# EAGLE design MiniGen (EAGLE 6.5.0)
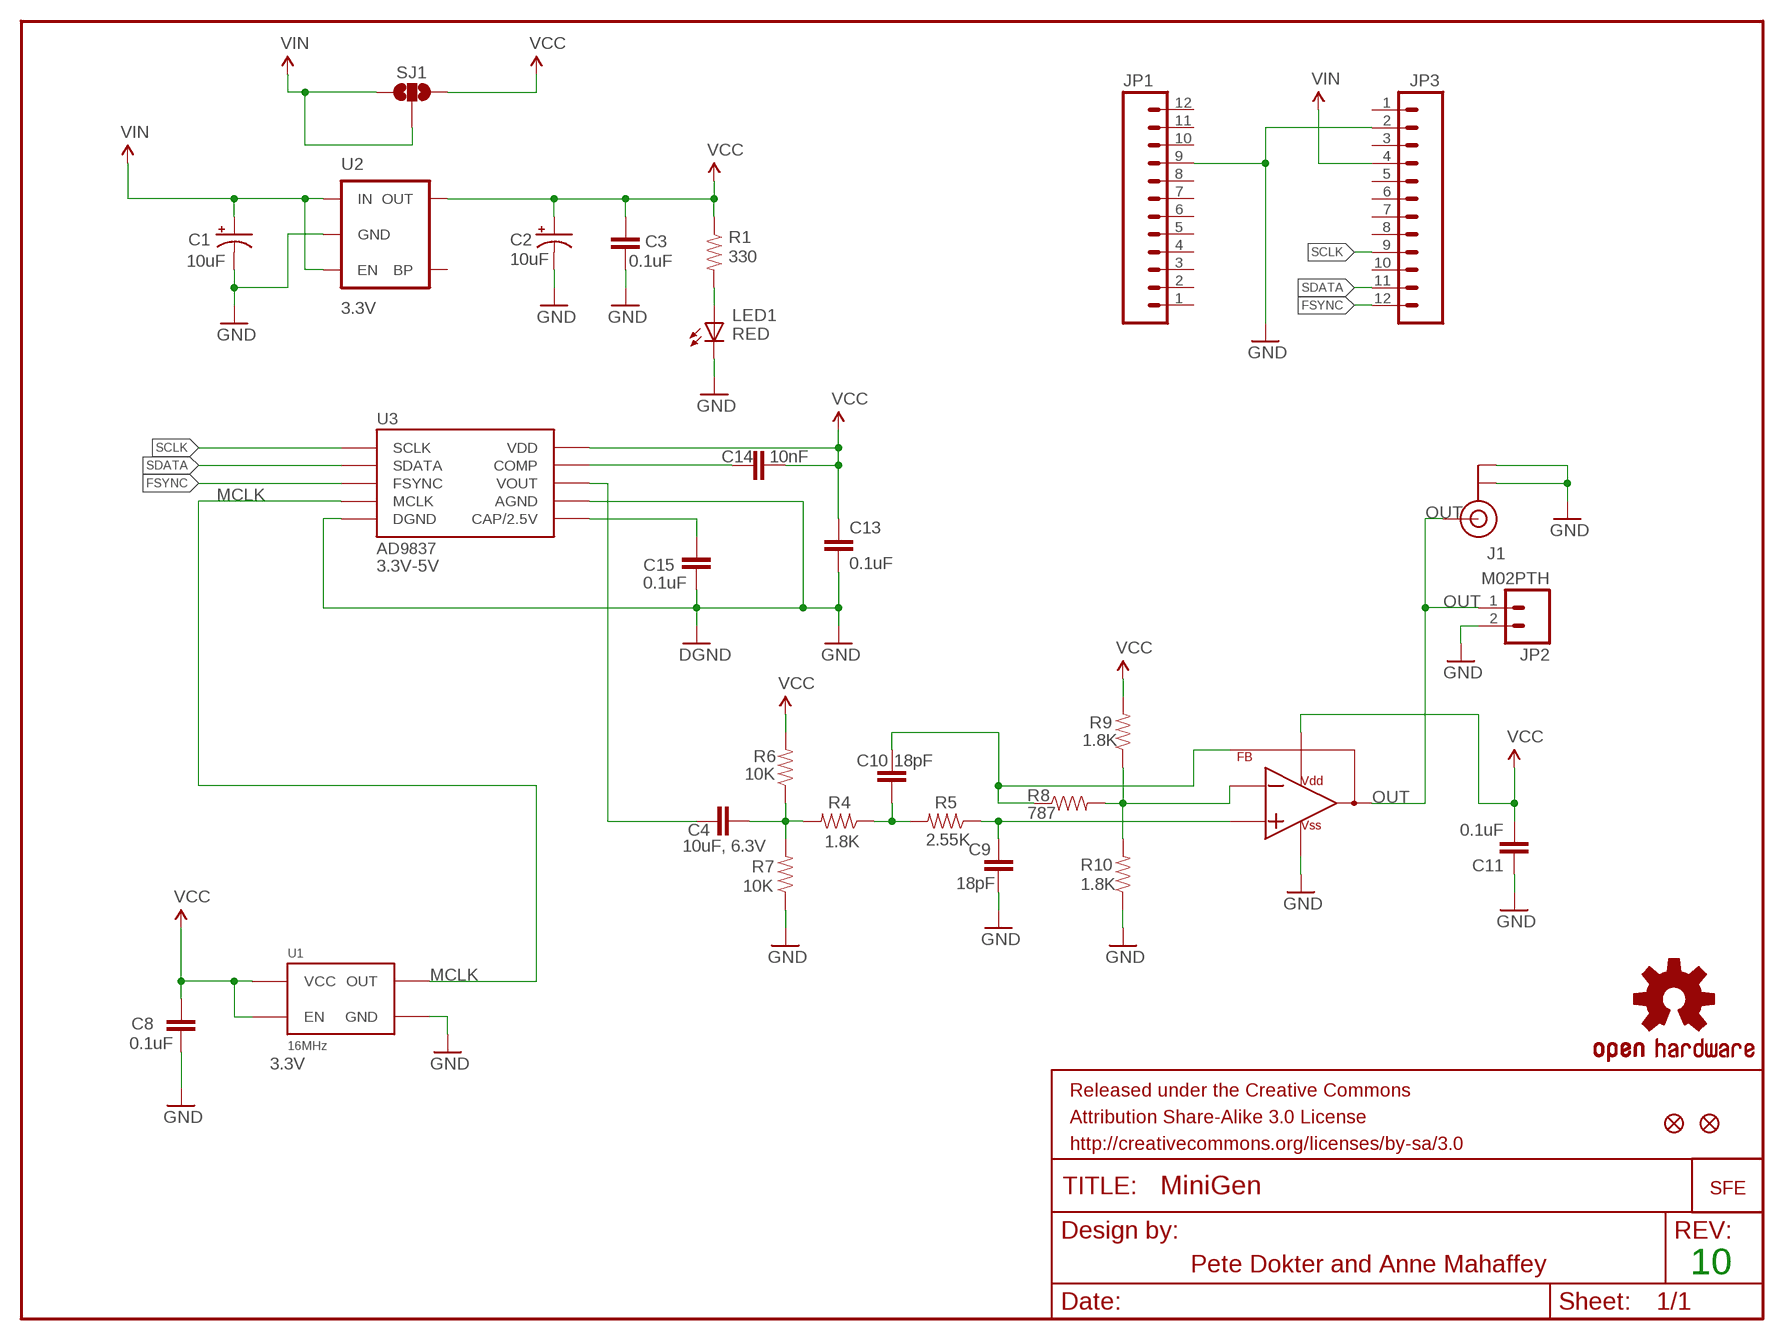
[diagram p0: schematic, sheet 1]

## Parts
C1  10uF  10UF-20V-10%(TANT)  [EIA3528]
C2  10uF  10UF-20V-10%(TANT)  [EIA3528]
C3  0.1uF  0.1UF-25V(+80/-20%)(0603)  [0603-CAP]
C4  10uF, 6.3V  10UF-6.3V-20%(0603)  [0603-CAP]
C8  0.1uF  0.1UF-25V(+80/-20%)(0603)  [0603-CAP]
C9  18pF  18PF-50V-5%(0603)  [0603-CAP]
C10  18pF  18PF-50V-5%(0603)  [0603-CAP]
C11  0.1uF  0.1UF-25V(+80/-20%)(0603)  [0603-CAP]
C13  0.1uF  0.1UF-25V(+80/-20%)(0603)  [0603-CAP]
C14  10nF  10NF/10000PF-50V-10%(0603)  [0603-CAP]
C15  0.1uF  0.1UF-25V(+80/-20%)(0603)  [0603-CAP]
FID1  FIDUCIAL1X2  [FIDUCIAL-1X2]
FID2  FIDUCIAL1X2  [FIDUCIAL-1X2]
FRAME1  FRAME-LETTER  [CREATIVE_COMMONS]
J1  U.FL  [U.FL]
JP1  M12PTH  [1X12]
JP2  M02PTH  [1X02]
JP3  M12PTH  [1X12]
JP4  LOGO-SFENEW  [SFE-NEW-WEBLOGO]
LED1  RED  LED-RED0603  [LED-0603]
R1  330  330OHM1/10W1%(0603)  [0603-RES]
R4  1.8K  1.8KOHM1/10W1%(0603)  [0603-RES]
R5  2.55K  2.55KOHM-1/10W-1%(0603)  [0603-RES]
R6  10K  10KOHM1/10W1%(0603)0603  [0603-RES]
R7  10K  10KOHM1/10W1%(0603)0603  [0603-RES]
R8  787  787-1%  [0603-RES]
R9  1.8K  1.8KOHM1/10W1%(0603)  [0603-RES]
R10  1.8K  1.8KOHM1/10W1%(0603)  [0603-RES]
SJ1  SOLDERJUMPER_2WAYT  [SJ_2]
U1  16MHz  OSCILLATORXTAL-11225  [CRYSTAL-SMD-7X5]
U2  3.3V  MIC52053.3V  [SOT23-5]
U3  AD9837  [AD9837]
U4  ADC8045  [SO08]
U$2  OSHW-LOGOS  [OSHW-LOGO-S]

## Nets
FSYNC: JP3.12 U3.P$8(FSYNC)
GND: C1.C(-) C2.C(-) C3.2 C8.2 C9.1 C11.1 C13.2 C15.2 J1.P$1(GND) J1.P$2(GND) JP1.9 JP2.2 JP3.2 LED1.C R7.1 R10.1 U1.P$2(GND) U2.2(GND) U3.P$0(DGND) U3.P$4(DGND) U3.P$9(AGND) U4.4(VSS)
MCLK: U1.P$3(OUT) U3.P$5(MCLK)
N$3: LED1.A R1.2
N$7: C9.2 R5.1 U4.3(IN+)
N$8: C10.1 R4.1 R5.2
N$9: C10.2 R8.1 U4.1(FB)
N$10: C15.1 U3.P$3(CAP/2.5V)
N$12: R8.2 R9.1 R10.2 U4.2(IN-)
N$14: C4.2 R4.2 R6.1 R7.2
N$21: C4.1 U3.P$10(VOUT)
N$23: C14.1 U3.P$1(COMP)
OUT: J1.P$3(SIGNAL) JP2.1 U4.6(OUT)
SCLK: JP3.9 U3.P$7(SCLK)
SDATA: JP3.11 U3.P$6(SDATA)
VCC: C2.A(+) C3.1 C8.1 C11.2 C13.1 C14.2 R1.1 R6.2 R9.2 SJ1.3 U1.P$1(EN) U1.P$4(VCC) U2.5(OUT) U3.P$2(VDD) U4.7(VDD)
VIN: C1.A(+) JP3.4 SJ1.1 SJ1.2 U2.1(IN) U2.3(EN)
Unconnected: JP1.1 JP1.2 JP1.3 JP1.4 JP1.5 JP1.6 JP1.7 JP1.8 JP1.10 JP1.11 JP1.12 JP3.1 JP3.3 JP3.5 JP3.6 JP3.7 JP3.8 JP3.10 U2.4(BP)

## Notes on the sheet
- 3.3V-5V
- 3.3V
- Pete Dokter and Anne Mahaffey | 10

## Library data of the parts
C1 C2 = SparkFun-Capacitors:10UF-20V-10%(TANT): CAP-08063; PROD_ID: CAP-08063
C3 C8 C11 C13 C15 = SparkFun-Capacitors:0.1UF-25V(+80/-20%)(0603): CAP-00810 Ceramic Standard decoupling cap; PROD_ID: CAP-00810
C4 = SparkFun-Capacitors:10UF-6.3V-20%(0603): CAP-11015; PROD_ID: CAP-11015; VALUE: 10uF
C9 C10 = SparkFun-Capacitors:18PF-50V-5%(0603): CAP-08267; PROD_ID: CAP-08267
C14 = SparkFun-Capacitors:10NF/10000PF-50V-10%(0603): CAP-00867; PROD_ID: CAP-00867
FID1 FID2 = SparkFun-Aesthetics:FIDUCIAL: Fiducial Alignment Points Various fiducial points for machine vision alignment.
FRAME1 = SparkFun-Aesthetics:FRAME-LETTER: Schematic Frame Standard 8.5x11 US Letter frame
J1 = SparkFun-Connectors:U.FL: SMD antenna connector- WRL-09144; PROD_ID: CONN-09193; VALUE: U.FL
JP1 JP3 = SparkFun-Connectors:M12: Header 12 Standard 12-pin 0.1" header. Use with straight break away headers (SKU : PRT-00116), right angle break away headers (PRT-00553), swiss pins (PRT-00743), machine pins (PRT-00117), and female headers (PRT-00115).
JP2 = SparkFun-Connectors:M02: Standard 2-pin 0.1" header. Use with - straight break away headers ( PRT-00116) - right angle break away headers (PRT-00553) - swiss pins (PRT-00743) - machine pins (PRT-00117) - female headers (PRT-00115) Molex polarized connector foot print use with: PRT-08233 with associated crimp pins and housings. 2.54_SCREWTERM for use with PRT-10571. 3.5mm Screw Terminal footprints for PRT-08084 5mm Screw Terminal footprints for use with PRT-08433
JP4 = SparkFun-Aesthetics:LOGO-SFE: Spark Fun Electronics PCB Logo This is the standard Spark Fun Electronics PCB logo.
LED1 = SparkFun-LED:LED-RED: Assorted Red LEDs LilyPad 1206- DIO-09912 1206- DIO-00809 0603- DIO-00819; PROD_ID: DIO-00819
R1 = SparkFun-Resistors:330OHM1/10W1%(0603): RES-00818; PROD_ID: RES-00818
R4 R9 R10 = SparkFun-Resistors:1.8KOHM1/10W1%(0603): RES-09119; PROD_ID: RES-09119; VALUE: 1.8k
R5 = SparkFun-Resistors:2.55KOHM-1/10W-1%(0603): RES-11227; PROD_ID: RES-11227; VALUE: 2.55k
R6 R7 = SparkFun-Resistors:10KOHM1/10W1%(0603): RES-00824; PROD_ID: RES-00824
R8 = SparkFun-Resistors:787-1%: 787-ohm SMT 1/10W - 1% (0603) RES-11228; PROD_ID: RES-11228
SJ1 = SparkFun-Passives:SOLDERJUMPER_2WAY: Solder Jumper 2 way solder jumper
U1 = SparkFun-FreqCtrl:OSCILLATOR: Generic 5x3 and 7x5 oscillators; PROD_ID: XTAL-11225
U2 = SparkFun-PowerIC:MIC5205: MIC5205 150mA vreg 3.3V - VREG-00822 5V - VREG-00823; PROD_ID: VREG-00822
U3 = SparkFun-AnalogIC:AD9837: Programmable waveform generator, sine, triangular, and square wave outputs.; PROD_ID: IC-11223; VALUE: AD9837BCPZ
U4 = SparkFun-AnalogIC:ADC8045: Unity-gain stable feedback amplifier. Low noise, low distortion, 1GHz BW.; PROD_ID: IC-11224; VALUE: ADC8045
U$2 = SparkFun-Aesthetics:OSHW-LOGO: Open Source Hardware Logo This logo indicates the piece of hardware it is found on incorporates a OSHW license and/or adheres to the definition of open source hardware found here: http://freedomdefined.org/OSHW

## Board
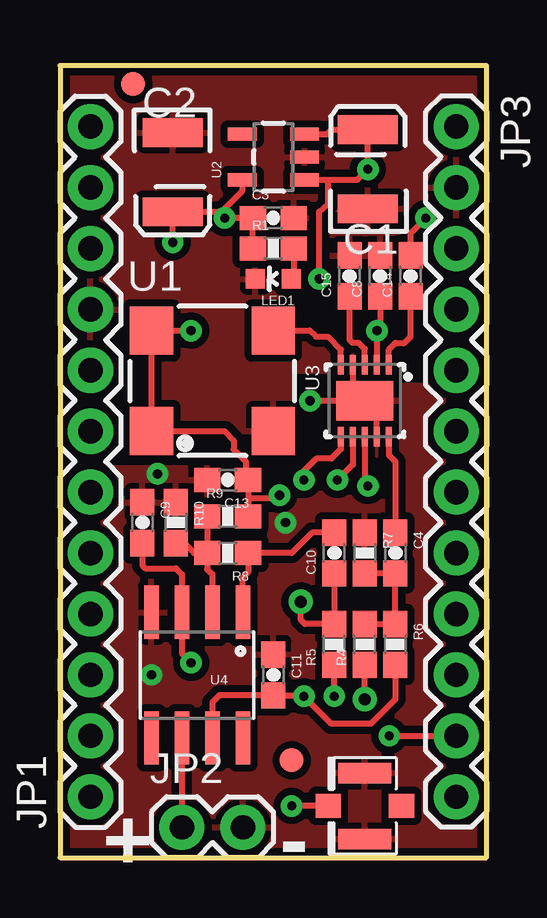
[diagram p1: board, top side]
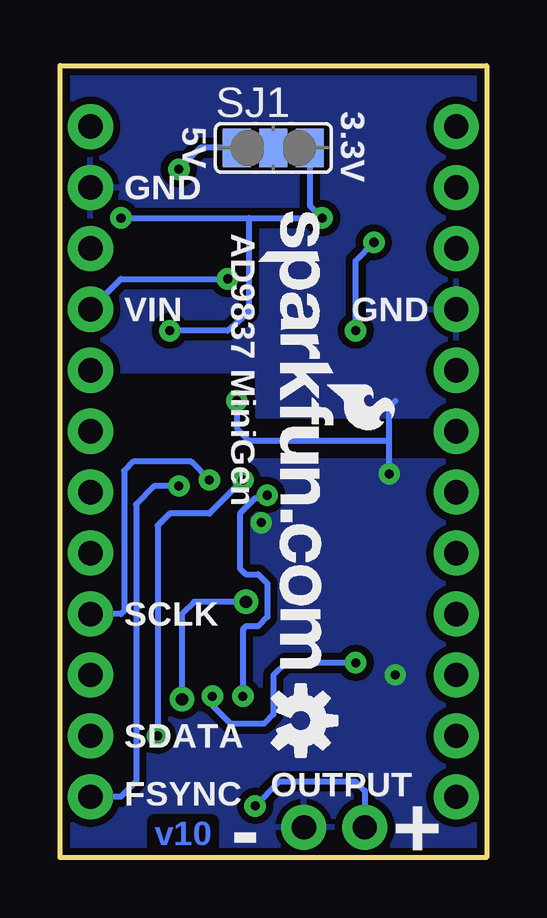
[diagram p2: board, bottom side, seen from below]

Size 17.78 x 33.02 mm. Coordinates in mm from the lower left corner, seen from the top.
Outline: 0,0 17.78,0 17.78,33.02 0,33.02 0,0
Copper layers (1*16): Top 0.035mm / dielectric 1.5mm / Bottom 0.035mm
Design rules "Sparkfun": minimum track width 8mil, minimum drill 20mil, track to track 8mil, track to pad 8mil, pad to pad 8mil, via to via 8mil, smd to smd 8mil, copper to edge 8mil, drill to drill 8mil, minimum pad ring 12mil, minimum via ring 10mil, stop-mask expansion 4mil, vias tented up to drill 20mil, thermal gap 10mil

### Footprints (pad centres in the part's own frame; a part is rotated, then mirrored left to right if it is on the bottom)
EIA3528 = smd 1.2 x 2.5: A 1.65,0; C -1.65,0
0603-CAP = smd 1.1 x 1: 1 -0.85,0; 2 0.85,0
FIDUCIAL-1X2 = smd 1 x 1: 1 0,0
U.FL = smd 2.2 x 0.85: P$1 0,1.375; P$2 0,-1.375 | smd 1.05 x 1: P$3 1.525,0; P$4 -1.525,0
1X12 = drill 1.016 pad 1.88: 1 0,0; 2 2.54,0; 3 5.08,0; 4 7.62,0; 5 10.16,0; 6 12.7,0; 7 15.24,0; 8 17.78,0; 9 20.32,0; 10 22.86,0; 11 25.4,0; 12 27.94,0
1X02 = drill 1.016 pad 1.88: 1 0,0; 2 2.54,0
LED-0603 = smd 0.8 x 0.8: A 0,-0.75; C 0,0.75
0603-RES = smd 1.1 x 1: 1 -0.85,0; 2 0.85,0
SJ_2 = smd 1.168 x 1.6: 1 -1.524,0; 2 0,0; 3 1.524,0
CRYSTAL-SMD-7X5 = smd 1.8 x 2: P$1 0,0; P$2 5.08,0; P$3 5.08,4.2; P$4 0,4.2
SOT23-5 = smd 0.55 x 1.2: 1 -0.95,-1.3; 2 0,-1.3; 3 0.95,-1.3; 4 0.95,1.3; 5 -0.95,1.3
AD9837 = smd 1.64 x 2.38: P$0 0,0 | smd 0.8 x 0.25: P$1 -1.5,1; P$2 -1.5,0.5; P$3 -1.5,0; P$4 -1.5,-0.5; P$5 -1.5,-1; P$6 1.5,-1; P$7 1.5,-0.5; P$8 1.5,0; P$9 1.5,0.5; P$10 1.5,1
SO08 = smd 0.61 x 2.21: 1 -1.905,-2.616; 2 -0.635,-2.616; 3 0.635,-2.616; 4 1.905,-2.616; 5 1.905,2.616; 6 0.635,2.616; 7 -0.635,2.616; 8 -1.905,2.616

### Placement (x,y rotation side)
C1  12.83,28.7 90 top
C2  4.7,28.57 270 top
C3  8.89,26.67 0 top
C4  13.97,12.7 270 top
C8  13.34,24.26 90 top
C9  3.43,13.97 270 top
C10  11.43,12.7 90 top
C11  8.89,7.62 270 top
C13  6.99,15.75 180 top
C14  14.61,24.26 90 top
C15  12.06,24.26 90 top
FID1  3.05,32.26 0 top
FID2  9.65,4.06 0 top
FRAME1  -5.96,-13.97 0 top  (outside the outline)
J1  12.7,2.16 180 top
JP1  1.27,2.54 90 top
JP2  5.08,1.27 0 top
JP3  16.51,30.48 270 top
JP4  9.53,26.92 270 bottom
LED1  8.89,24.13 90 top
R1  8.89,25.4 0 top
R4  12.7,8.89 90 top
R5  11.43,8.89 90 top
R6  13.97,8.89 270 top
R7  12.7,12.7 270 top
R8  6.99,12.7 180 top
R9  6.99,14.22 0 top
R10  4.83,13.97 270 top
SJ1  8.89,29.59 0 bottom
U1  3.81,17.78 0 top
U2  8.89,29.21 90 top
U3  12.7,19.05 270 top
U4  5.71,7.62 180 top
U$2  7.75,5.71 270 bottom

### Tracks (layer width: path | path; a pad name or v marks a point on that pad's centre or on a via)
FSYNC  (via drill 0.38)
  Top 0.254: U3.P$8 12.7,15.62 v12.83,15.49
  Bottom 0.254: v12.83,15.49 13.84,15.49 14.61,14.73 14.61,3.17 15.24,2.54 JP3.12
GND  (via drill 0.38)
  Top 0.254: U3.P$9 13.2,18.55 U3.P$0 | U3.P$4 12.2,19.55 U3.P$0 | v10.41,19.05 U3.P$0
  Bottom 0.254: v4.06,16 4.06,17.4 | v10.41,19.05 10.41,17.91 9.91,17.4 4.06,17.4 | 4.06,17.4 4.06,18.8 3.81,19.05
  other vias: 9.4,13.97 3.81,7.62
  pour Bottom (isolate 0.305): 0,33.02 0,18.41 9.53,18.41 9.53,20.32 17.78,20.32 17.78,33.02
  pour Top (isolate 0.305): 0,33.02 0,17.14 9.53,17.14 9.53,20.32 17.78,20.32 17.78,33.02
  pour Top (isolate 0.305): 0,0 0,16.26 11.43,16.26 11.43,19.68 17.78,19.68 17.78,0
  pour Bottom (isolate 0.305): 0,0 0,16.51 11.43,16.51 11.43,19.68 17.78,19.68 17.78,0
MCLK
  Top 0.254: U1.P$3 10.4,21.98 10.67,21.72 11.18,21.72 11.7,21.19 U3.P$5
N$3
  Top 0.254: R1.2 9.74,24.23 LED1.A
N$7  (via drill 0.38)
  Top 0.254: C9.2 3.43,12.19 3.56,12.06 4.83,12.06 5.08,11.81 U4.3 5.08,8.51 v5.46,8.13 | v11.43,6.73 R5.1
  Bottom 0.254: v5.46,8.13 8.38,8.13 8.89,7.62 8.89,5.97 9.27,5.59 10.67,5.59 11.43,6.35 v11.43,6.73
N$8  (via drill 0.51)
  Top 0.254: C10.1 R5.2 10.2,9.74 10.03,9.91 v10.03,10.67 | v12.7,6.6 R4.1
  Bottom 0.254: v10.03,10.67 12.19,10.67 12.7,10.16 v12.7,6.6
N$9
  Top 0.254: C10.2 10.5,13.55 9.65,12.7 R8.1 7.83,11.9 7.62,11.68 U4.1
N$10
  Top 0.254: U3.P$3 12.7,21.21 12.45,21.46 12.19,21.46 12.06,21.59 C15.1
N$12
  Top 0.254: R10.2 5.17,13.12 5.59,12.7 R8.2 | R9.1 R8.2 | R8.2 6.13,12.03 6.35,11.81 U4.2
N$14
  Top 0.254: R7.2 C4.2 R6.1 R4.2
N$21
  Top 0.254: U3.P$10 13.7,16.78 13.97,16.51 C4.1
N$23
  Top 0.254: U3.P$1 13.7,21.19 13.97,21.46 14.35,21.46 14.61,21.72 C14.1
OUT  (via drill 0.38)
  Top 0.254: U4.6 JP2.1 | J1.P$3 v9.65,2.16
  Bottom 0.254: v9.65,2.16 8.64,3.17 5.46,3.17 5.08,2.79 JP2.1
SCLK  (via drill 0.38)
  Top 0.254: U3.P$7 12.2,16.39 v11.56,15.75
  Bottom 0.254: v11.56,15.75 12.32,16.51 14.73,16.51 15.11,16.13 15.11,10.29 15.24,10.16 JP3.9
SDATA  (via drill 0.38)
  Top 0.254: U3.P$6 11.7,17.03 11.3,16.64 10.67,16.64 10.16,16.13 v10.16,15.75 | v13.72,5.08 JP3.11
  Bottom 0.254: v10.16,15.75 11.56,14.35 13.21,14.35 13.72,13.84 v13.72,5.08
VCC  (via drill 0.38)
  Top 0.254: C8.1 13.34,21.72 v13.21,21.97 U3.P$2 | C14.2 14.61,26.04 v15.24,26.67 | v6.86,26.67 6.6,26.93 C2.A v4.7,25.65 | v6.86,26.67 6.86,27.05 7.59,27.78 U2.5 | C3.1 7.62,26.67 | C3.1 v6.86,26.67 | R1.1 C3.1 | 7.83,14.99 C13.1 7.75,15.84 7.75,16.51 7.24,17.02 7.24,17.4 6.86,17.78 U1.P$1 U1.P$4 5.33,21.98 v5.46,21.97 | 7.83,14.99 R9.2 | 7.83,14.99 9.14,14.99 v9.14,15.11 | R6.2 13.97,6.6 12.95,5.59 11.3,5.59 v10.16,6.73 10.12,6.77 C11.2 6.64,6.77 6.35,6.48 U4.7
  Bottom 0.254: v15.24,26.67 9.91,26.67 | 9.91,26.67 v6.86,26.67 7.37,27.18 SJ1.3 | 9.91,26.67 9.91,22.73 10.79,21.97 v13.21,21.97 | v9.14,15.11 9.27,14.99 9.65,14.99 10.29,14.35 10.29,12.06 10.03,11.81 9.53,11.81 9.14,11.43 9.14,10.03 9.53,9.65 10.03,9.65 10.16,9.53 v10.16,6.73 | v5.46,21.97 5.46,24.89 v4.7,25.65
VIN  (via drill 0.38)
  Top 0.254: U2.3 11.11,30.16 11.3,30.35 C1.A v12.83,28.7 12.38,28.26 11.18,28.26 | U2.1 11.18,28.26 | v10.79,24.13 10.79,26.92 11.18,27.24 11.18,28.26
  Bottom 0.254: SJ1.2 SJ1.1 11.94,29.59 v12.83,28.7 | JP3.4 15.24,24.13 v10.79,24.13

### Text on the board
Bottom: v10
tPlace: + | -
bPlace: 3.3V | 5V | GND | AD9837 MiniGen | GND | VIN | SCLK | SDATA | OUTPUT | FSYNC | + | -
tValues: Pete Dokter and Anne Mahaffey
tDocu: Pete Dokter and Anne Mahaffey